# Altium schematic sheet 7Segment-Display.SchDoc
size A4
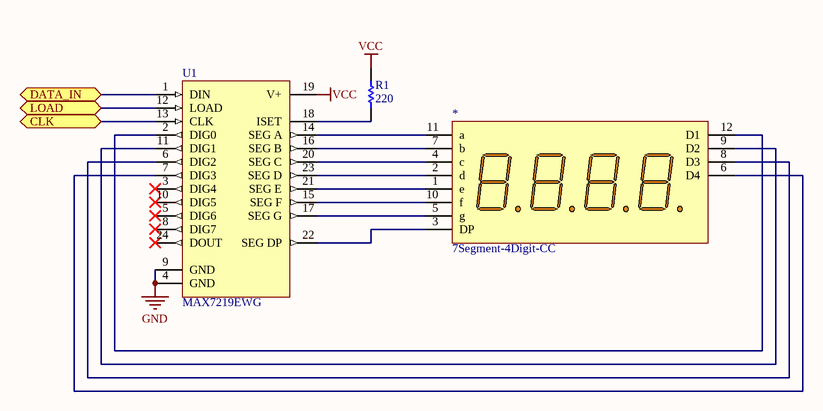
[diagram p0: 7Segment-Display.SchDoc]

## Parts
*  7Segment-4Digit-CC  [7Segment-4Digit-CC]
R1  220  [0207/10]
U1  MAX7219EWG  [WSO24_N]

## Ports
CLK (bidir), DATA_IN (bidir), LOAD (bidir)

## Nets
GND: U1.4(GND) U1.9(GND)
VCC: R1.1 U1.19(V+)
CLK: U1.13(CLK) ; port CLK
DATA_IN: U1.1(DIN) ; port DATA_IN
LOAD: U1.12(LOAD) ; port LOAD
Net*_1: *.1(e) U1.21(SEG_E)
Net*_2: *.2(d) U1.23(SEG_D)
Net*_3: *.3(DP) U1.22(SEG_DP)
Net*_4: *.4(c) U1.20(SEG_C)
Net*_5: *.5(g) U1.17(SEG_G)
Net*_6: *.6(D4) U1.7(DIG3)
Net*_7: *.7(b) U1.16(SEG_B)
Net*_8: *.8(D3) U1.6(DIG2)
Net*_9: *.9(D2) U1.11(DIG1)
Net*_10: *.10(f) U1.15(SEG_F)
Net*_11: *.11(a) U1.14(SEG_A)
Net*_12: *.12(D1) U1.2(DIG0)
NetR1_2: R1.2 U1.18(ISET)

Not connected (* = marked no-connect by the designer): U1 3(DIG4)* 5(DIG6)* 8(DIG7)* 10(DIG5)* 24(DOUT)*

## Notes on the sheet
- Title
- Size:
- Date:
- A4
- Number:
- Time:
- Revision:
- Sheet
- of
- File:

## Library data of the parts
R1 = Res1: Resistor; Published: 8-Jun-2000; LatestRevisionDate: 17-Jul-2002; LatestRevisionNote: Re-released for DXP Platform.; PackageReference: AXIAL-0.3; Publisher: Altium Limited; PackageDescription: Axial Device, Thru-Hole; 2 Leads; 0.3 in Pin Spacing; Value: 220
U1 = MAX7219EWG: Serially Interfaced, 8-Digit LED Display Driver; Published: 16-Jan-2001; LatestRevisionDate: 13-Apr-2006; LatestRevisionNote: IPC-7351 Footprint Added.; DatasheetVersion: Jul-1997; PackageReference: WSO24; Publisher: Altium Limited; PackageDescription: 24-Pin Small Outline Integrated Circuit 1.27 mm Pitch; ComponentLink1Description: Manufacturer Link; ComponentLink1URL: http://www.maxim-ic.com/; ComponentLink2Description: Datasheet; ComponentLink2URL: http://pdfserv.maxim-ic.com/en/ds/MAX7219-MAX7221.pdf